# Altium project CLOCK.PrjPcb
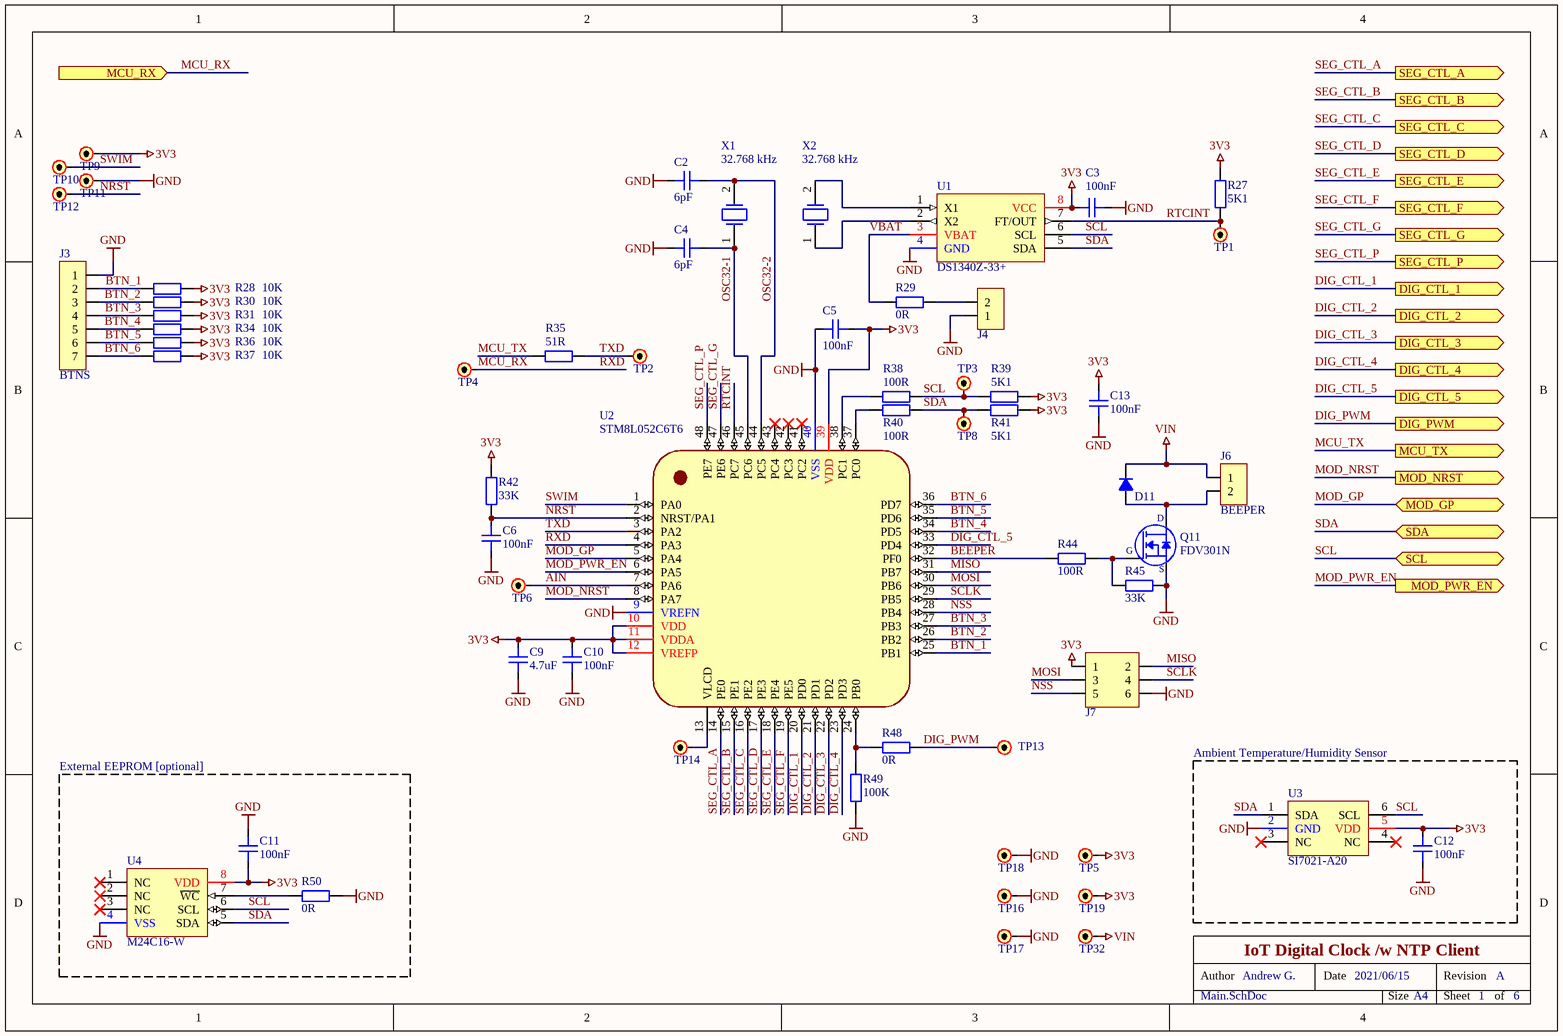
[diagram p0: Main.SchDoc]
Title: IoT Digital Clock /w NTP Client; SheetTotal: 6; Revision: A; DrawnBy: Andrew G.; Date: 2021/06/15
5 sheets, 193 parts. Net scope: flat (ports and power ports of the same name join across sheets).
Board file: CLOCK.PcbDoc
Sheets:
  Main.SchDoc
  Anode.SchDoc
  PowerIn.SchDoc
  WiFi.SchDoc
  Cathode.SchDoc

## Sheet Main.SchDoc: IoT Digital Clock /w NTP Client
size A4; Date: 2021/06/15; DrawnBy: Andrew G.; DocumentNumber: 1; Revision: A; SheetNumber: 1; SheetTotal: 6; ProjectName: CLOCK.PrjPcb

### Parts
C2  6pF  [0603C_RF_M]
C3  100nF  [0603C_RF_M]
C4  6pF  [0603C_RF_M]
C5  100nF  [0603C_RF_M]
C6  100nF  [0603C_RF_M]
C9  4.7uF  [0603C_RF_M]
C10  100nF  [0603C_RF_M]
C11  100nF  [0603C_RF_M]
C12  100nF  [0603C_RF_M]
C13  100nF  [0805C_RF_M]
D11  D  [ONSEMI_DO214AC_RF_M]  (value not drawn)
J3  BTNS  [HEADER-2.54-7P1]
J4  PINHDR-2P1  [HEADER-2.54-2P1]  (value not drawn)
J6  BEEPER  [HEADER-2.54-2P1]
J7  PINHDR-6P2-2.54  [HEADER-2.54-6P-2R]  (value not drawn)
Q11  FDV301N  [IRLML_SOT-23]
R27  5K1  [0603R_RF_M]
R28  10K  [0603R_RF_M]
R29  0R  [0805R_RF_M]
R30  10K  [0603R_RF_M]
R31  10K  [0603R_RF_M]
R34  10K  [0603R_RF_M]
R35  51R  [0603R_RF_M]
R36  10K  [0603R_RF_M]
R37  10K  [0603R_RF_M]
R38  100R  [0603R_RF_M]
R39  5K1  [0805R_RF_M]
R40  100R  [0603R_RF_M]
R41  5K1  [0805R_RF_M]
R42  33K  [0603R_RF_M]
R44  100R  [0805R_RF_M]
R45  33K  [0805R_RF_M]
R48  0R  [0603R_RF_M]
R49  100K  [0603R_RF_M]
R50  0R  [0603R_RF_M]
TP1  RTCINT  [PAD_R_1MM]  (value not drawn)
TP2  MCU_TX  [PAD_R_1MM]  (value not drawn)
TP3  SCL  [PAD_R_1MM]  (value not drawn)
TP4  MCU_RX  [PAD_R_1MM]  (value not drawn)
TP5  3V3  [PAD_R_1.5MM]  (value not drawn)
TP6  3V3  [PAD_R_1MM]  (value not drawn)
TP8  SDA  [PAD_R_1MM]  (value not drawn)
TP9  VDD  [PAD_R_1MM]  (value not drawn)
TP10  SWIM  [PAD_R_1MM]  (value not drawn)
TP11  GND  [PAD_R_1MM]  (value not drawn)
TP12  NRST  [PAD_R_1MM]  (value not drawn)
TP13  PWM  [PAD_R_1MM]  (value not drawn)
TP14  VLCD  [PAD_R_1MM]  (value not drawn)
TP16  GND  [PAD_R_1.5MM]  (value not drawn)
TP17  GND  [PAD_R_1.5MM]  (value not drawn)
TP18  GND  [PAD_R_1.5MM]  (value not drawn)
TP19  3V3  [PAD_R_1.5MM]  (value not drawn)
TP32  VIN  [PAD_R_1.5MM]  (value not drawn)
U1  DS1340Z-33+  [SOIC-8]
U2  STM8L052C6T6  [ST_LQFP-48]
U3  SI7021-A20  [SI7021_DFN-6_RF_M]
U4  M24C16-W  [SOIC-8]
X1  32.768 kHz  [XTAL_3215]
X2  32.768 kHz  [XTAL_3215]

### Blocks framed on the sheet
External EEPROM [optional]: C11 R50 U4
Ambient Temperature/Humidity Sensor: C12 U3

### Ports
DIG_CTL_1 (out), DIG_CTL_2 (out), DIG_CTL_3 (out), DIG_CTL_4 (out), DIG_CTL_5 (out), DIG_PWM (out), MCU_RX (in), MCU_TX (out), MOD_GP (bidir), MOD_NRST (out), MOD_PWR_EN (out), SCL (bidir), SDA (bidir), SEG_CTL_A (out), SEG_CTL_B (out), SEG_CTL_C (out), SEG_CTL_D (out), SEG_CTL_E (out), SEG_CTL_F (out), SEG_CTL_G (out), SEG_CTL_P (out)

### Nets
3V3: C3.2 C5.1 C9.2 C10.2 C11.2 C12.2 C13.2 J7.1 R27.2 R28.2 R30.2 R31.2 R34.2 R36.2 R37.2 R39.2 R41.2 R42.2 TP5.1 TP9.1 TP19.1 U1.8(VCC) U2.10(VDD) U2.11(VDDA) U2.12(VREFP) U2.39(VDD) U3.5(VDD) U4.8(VDD)
GND: C2.2 C3.1 C4.2 C5.2 C6.1 C9.1 C10.1 C11.1 C12.1 C13.1 J3.1 J4.1 J7.6 Q11.2(S) R45.1 R49.2 R50.2 TP11.1 TP16.1 TP17.1 TP18.1 U1.4(GND) U2.9(VREFN) U2.40(VSS) U3.2(GND) U4.4(VSS)
VIN: D11.C J6.1 TP32.1
AIN: TP6.1 U2.7(PA6)
BEEPER: R44.1 U2.32(PF0)
BTN_1: J3.2 R28.1 U2.25(PB1)
BTN_2: J3.3 R30.1 U2.26(PB2)
BTN_3: J3.4 R31.1 U2.27(PB3)
BTN_4: J3.5 R34.1 U2.34(PD5)
BTN_5: J3.6 R36.1 U2.35(PD6)
BTN_6: J3.7 R37.1 U2.36(PD7)
DIG_CTL_1: U2.20(PD0) ; port DIG_CTL_1
DIG_CTL_2: U2.21(PD1) ; port DIG_CTL_2
DIG_CTL_3: U2.22(PD2) ; port DIG_CTL_3
DIG_CTL_4: U2.23(PD3) ; port DIG_CTL_4
DIG_CTL_5: U2.33(PD4) ; port DIG_CTL_5
DIG_PWM: R48.1 TP13.1 ; port DIG_PWM
MCU_RX: TP4.1 U2.4(PA3) ; port MCU_RX  [also labelled RXD]
MCU_TX: R35.1 ; port MCU_TX
MISO: J7.2 U2.31(PB7)
MOD_GP: U2.5(PA4) ; port MOD_GP
MOD_NRST: U2.8(PA7) ; port MOD_NRST
MOD_PWR_EN: U2.6(PA5) ; port MOD_PWR_EN
MOSI: J7.3 U2.30(PB6)
NRST: C6.2 R42.1 TP12.1 U2.2(NRST/PA1)
NSS: J7.5 U2.28(PB4)
OSC32-1: C4.1 U2.45(PC6) X1.1
OSC32-2: C2.1 U2.44(PC5) X1.2
RTCINT: R27.1 TP1.1 U1.7(FT/OUT) U2.46(PC7)
SCL: R38.2 R39.1 TP3.1 U1.6(SCL) U3.6(SCL) U4.6(SCL) ; port SCL  [project net MCU_SCL]
SCLK: J7.4 U2.29(PB5)
SDA: R40.2 R41.1 TP8.1 U1.5(SDA) U3.1(SDA) U4.5(SDA) ; port SDA  [project net MCU_SDA]
SEG_CTL_A: U2.14(PE0) ; port SEG_CTL_A
SEG_CTL_B: U2.15(PE1) ; port SEG_CTL_B
SEG_CTL_C: U2.16(PE2) ; port SEG_CTL_C
SEG_CTL_D: U2.17(PE3) ; port SEG_CTL_D
SEG_CTL_E: U2.18(PE4) ; port SEG_CTL_E
SEG_CTL_F: U2.19(PE5) ; port SEG_CTL_F
SEG_CTL_G: U2.47(PE6) ; port SEG_CTL_G
SEG_CTL_P: U2.48(PE7) ; port SEG_CTL_P
SWIM: TP10.1 U2.1(PA0)
TXD: R35.2 TP2.1 U2.3(PA2)
VBAT: R29.2 U1.3(VBAT)
NetD11_A: D11.A J6.2 Q11.3(D)
NetJ4_2: J4.2 R29.1
NetQ11_1: Q11.1(G) R44.2 R45.2
NetR38_1: R38.1 U2.38(PC1)
NetR40_1: R40.1 U2.37(PC0)
NetR48_2: R48.2 R49.1 U2.24(PB0)
NetR50_1: R50.1 U4.7(~{WC})
NetTP14_1: TP14.1 U2.13(VLCD)
NetU1_1: U1.1(X1) X2.2
NetU1_2: U1.2(X2) X2.1

Not connected (* = marked no-connect by the designer): U2 41(PC2)* 42(PC3)* 43(PC4)*; U3 3(NC)* 4(NC)*; U4 1(NC)* 2(NC)* 3(NC)*

### Notes on the sheet
- Author
- Date
- Revision
- Size
- A4
- Sheet
- of

### Library data of the parts
C2-C6 C9-C13 = C: Capacitor; Manufacturer: Generic Brand; Max Voltage: ? V; Tolerance: ?; Mounting Technology: SMT; Tag: *; Manufacturer Part No: *; Supplier: *; Supplier Link: http://; Supplier Part No: *; Category: Capacitor
  C2 C4: Value: 6pF
  C3 C5 C6 C10-C13: Value: 100nF
  C9: Value: 4.7uF
D11 = D: Diode (Rectifier); Manufacturer: Generic Brand; Max Forward Voltage: ? V; Power Rating: ? W; Manufacturer Part No: *; Supplier: *; Supplier Link: http://; Supplier Part No: *; Mounting Technology: SMT; Category: Diode
J3 = PINHDR-7P1: Pin Header Single Row 7 Positions; Mounting Technology: THT
J4 J6 = PINHDR-2P1: Pin Header Single Row 2 Positions; Mounting Technology: THT
J7 = PINHDR-6P2-2.54: Rectangular Pin Header 6 Positions 2 Rows
Q11 = FDV301N: MOSFET N-CH 25V 220MA SOT23; Manufacturer: ON Semiconductor; Manufacturer Part No: FDV301N; Supplier: DigiKey; Supplier Link: https://www.digikey.com/en/products/detail/on-semiconductor/FDV301N/458851; Supplier Part No: FDV301NCT-ND; Mounting Technology: SMT; Package: SOT-23; Alternative Supplier: Chipdip; Alternative Supplier Part No: 9010000157; Alternative Supplier Link: https://www.chipdip.by/product/fdv301n-2
R27-R31 R34-R42 R44 R45 R48-R50 = R: Resistor; Manufacturer: Generic Brand; Power Rating: ? W; Max Voltage: ? V; Tolerance: ?; Supplier Link: http://; Category: Resistor; Mounting Technology: SMT
  R27 R39 R41: Value: 5K1
  R28 R30 R31 R34 R36 R37: Value: 10K
  R29 R48 R50: Value: 0R
  R35: Value: 51R
  R38 R40 R44: Value: 100R
  R42 R45: Value: 33K
  R49: Value: 100K
TP1-TP6 TP8-TP14 TP16-TP19 TP32 = Test Point: Test Point / Pad
U1 = DS1340Z-33+: IC RTC CLK/CALENDAR I2C 8-SOIC; Manufacturer: Maxim Integrated; VCC: 3.3V; Manufacturer Part No: DS1340Z-33+; Alternative Supplier: Chipdip; Alternative Supplier Link: https://www.chipdip.by/product/ds1340z-33-2; Alternative Supplier Part No: 9000387657; Supplier Part No: DS1340Z-33+-ND; Supplier: DigiKey; Supplier Link: https://www.digikey.com/en/products/detail/maxim-integrated/DS1340Z-33/680583; Mounting Technology: SMT; Package: SOIC-8; Category: IC/RTC
U2 = STM8L052C6T6: IC MCU 8BIT 32KB FLASH 48LQFP; Manufacturer: STMicroelectronics; Supplier: DigiKey; Supplier Link: https://www.digikey.com/en/products/detail/stmicroelectronics/STM8L052C6T6/3317784; Supplier Part No: 497-13041-ND; Manufacturer Product Number: STM8L052C6T6; Package: LQFP-48; Mounting Technology: SMT
U3 = SI7021-A20: SENS HUMID/TEMP 3.6V I2C 2% 6DFN; Manufacturer Product Number: SI7021-A20-GM1R; Manufacturer: Silicon Labs; Supplier URL: https://www.digikey.com/en/products/detail/silicon-labs/SI7021-A20-GM1/5048934; Supplier Part No: 336-4380-1-ND; Supplier Package: Cut Tape (CT); Mounting Type: SMT; Package: DFN-6
U4 = M24C16-W: IC SRL EEPROM 16KBIT 2.5V 8-SOIC; Manufacturer: STMicroelectronics; Manufacturer Product Number: M24C16-WMN6TP; Base Product Number: M24C16; Supplier: DigiKey; Supplier URL: https://www.digikey.com/en/products/detail/stmicroelectronics/M24C16-WMN6TP/1007246; Supplier Part No: 497-17785-1-ND; Supplier Package: Cut Tape; Mounting Type: SMT; Operating Temperature: -40°C ~ 85°C (TA); Supplier Price: $0.14
X1 X2 = KX-327NHT: Crystal Resonator (2 Leads); Manufacturer: Geyer; Load Capacitance: 12.5 pF; Tolerance: 20 ppm; Manufacturer Part No: KX-327NHT; Mounting Technology: SMT; Alternative Supplier: Belchip; Alternative Supplier Link: https://belchip.by/product/?selected_product=33387; Alternative Supplier Part No: 33387; Category: Crystal; Value: 32.768 kHz

## Sheet Anode.SchDoc: IoT Digital Clock /w NTP Client
size A4; Date: 2021/06/15; DrawnBy: Andrew G.; DocumentNumber: 1; Revision: A; SheetNumber: 2; SheetTotal: 6; ProjectName: CLOCK.PrjPcb
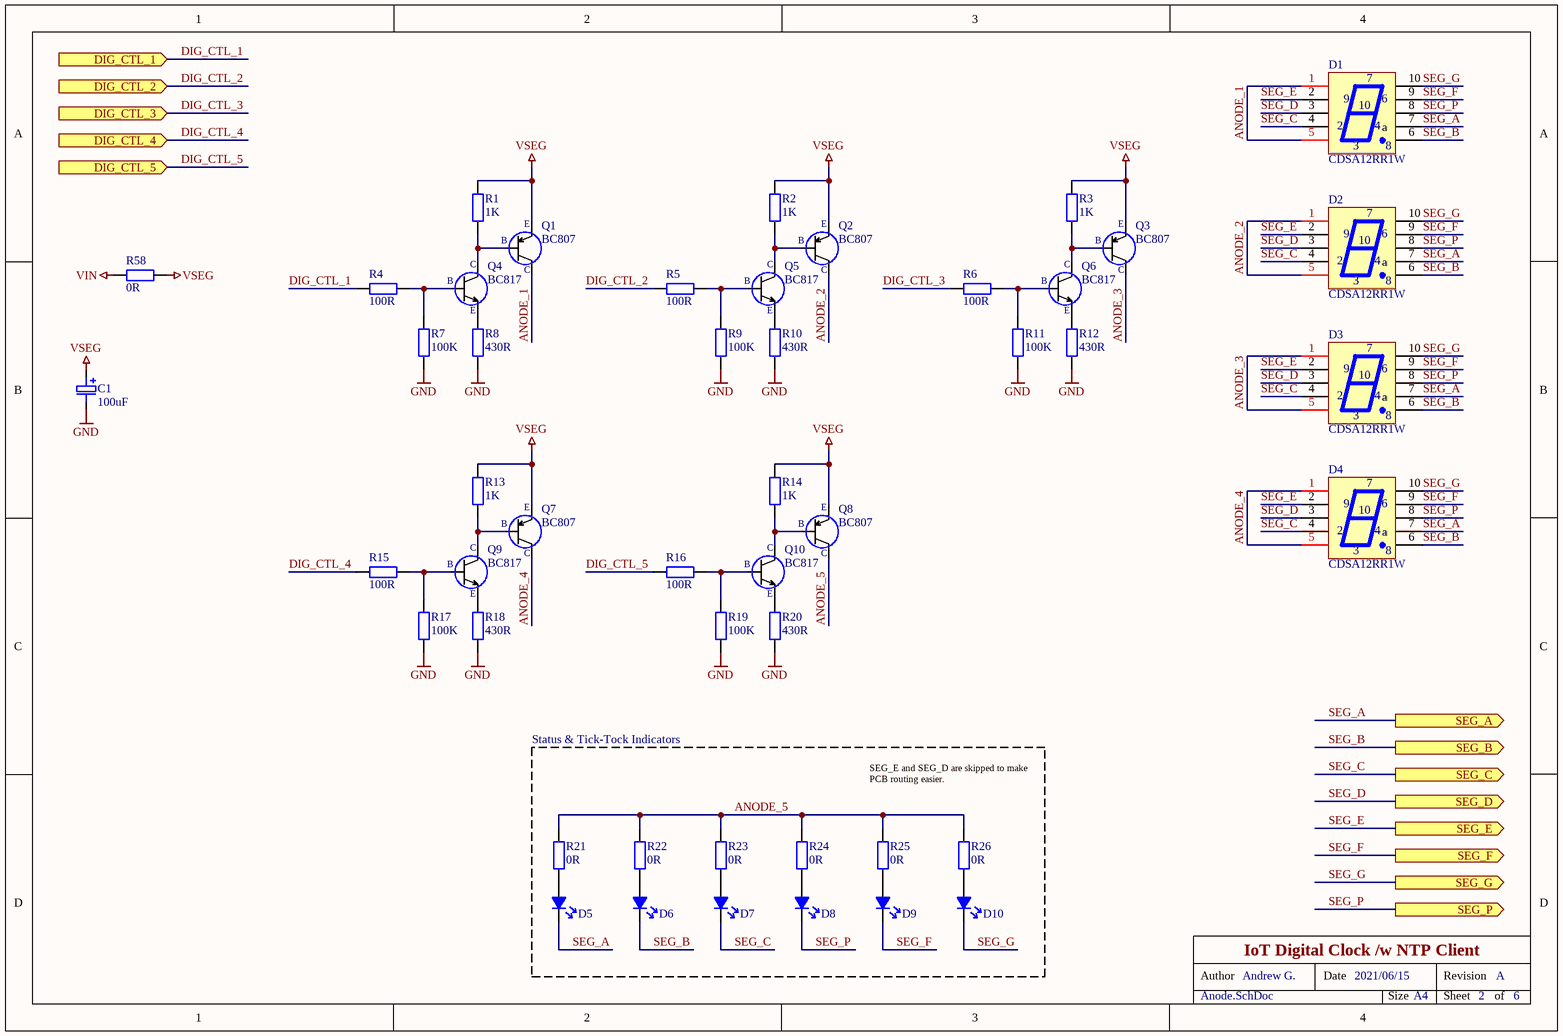
[diagram p1: Anode.SchDoc]

### Parts
C1  100uF  [C_EL_B_4MM_RF_M]
D1  CDSA12RR1W  [CDSX12]
D2  CDSA12RR1W  [CDSX12]
D3  CDSA12RR1W  [CDSX12]
D4  CDSA12RR1W  [CDSX12]
D5  Unspecified  [1206LED_RF_M]  (value not drawn)
D6  Unspecified  [1206LED_RF_M]  (value not drawn)
D7  Unspecified  [1206LED_RF_M]  (value not drawn)
D8  Unspecified  [1206LED_RF_M]  (value not drawn)
D9  Unspecified  [1206LED_RF_M]  (value not drawn)
D10  Unspecified  [1206LED_RF_M]  (value not drawn)
Q1  BC807  [IRLML_SOT-23]
Q2  BC807  [IRLML_SOT-23]
Q3  BC807  [IRLML_SOT-23]
Q4  BC817  [IRLML_SOT-23]
Q5  BC817  [IRLML_SOT-23]
Q6  BC817  [IRLML_SOT-23]
Q7  BC807  [IRLML_SOT-23]
Q8  BC807  [IRLML_SOT-23]
Q9  BC817  [IRLML_SOT-23]
Q10  BC817  [IRLML_SOT-23]
R1  1K  [0805R_RF_M]
R2  1K  [0805R_RF_M]
R3  1K  [0805R_RF_M]
R4  100R  [0805R_RF_M]
R5  100R  [0805R_RF_M]
R6  100R  [0805R_RF_M]
R7  100K  [0805R_RF_M]
R8  430R  [0805R_RF_M]
R9  100K  [0805R_RF_M]
R10  430R  [0805R_RF_M]
R11  100K  [0805R_RF_M]
R12  430R  [0805R_RF_M]
R13  1K  [0805R_RF_M]
R14  1K  [0805R_RF_M]
R15  100R  [0805R_RF_M]
R16  100R  [0805R_RF_M]
R17  100K  [0805R_RF_M]
R18  430R  [0805R_RF_M]
R19  100K  [0805R_RF_M]
R20  430R  [0805R_RF_M]
R21  0R  [0805R_RF_M]
R22  0R  [0805R_RF_M]
R23  0R  [0805R_RF_M]
R24  0R  [0805R_RF_M]
R25  0R  [0805R_RF_M]
R26  0R  [0805R_RF_M]
R58  0R  [1206R_RF_M]

### Blocks framed on the sheet
Status & Tick-Tock Indicators: D5-D10 R21-R26

### Ports
DIG_CTL_1 (in), DIG_CTL_2 (in), DIG_CTL_3 (in), DIG_CTL_4 (in), DIG_CTL_5 (in), SEG_A (out), SEG_B (out), SEG_C (out), SEG_D (out), SEG_E (out), SEG_F (out), SEG_G (out), SEG_P (out)

### Nets
GND: C1.N R7.1 R8.1 R9.1 R10.1 R11.1 R12.1 R17.1 R18.1 R19.1 R20.1
VIN: R58.1
VSEG: C1.P Q1.2(Emmiter) Q2.2(Emmiter) Q3.2(Emmiter) Q7.2(Emmiter) Q8.2(Emmiter) R1.2 R2.2 R3.2 R13.2 R14.2 R58.2
ANODE_1: D1.1(A) D1.5(A) Q1.3(Collector)
ANODE_2: D2.1(A) D2.5(A) Q2.3(Collector)
ANODE_3: D3.1(A) D3.5(A) Q3.3(Collector)
ANODE_4: D4.1(A) D4.5(A) Q7.3(Collector)
ANODE_5: Q8.3(Collector) R21.2 R22.2 R23.2 R24.2 R25.2 R26.2
DIG_CTL_1: R4.1 ; port DIG_CTL_1
DIG_CTL_2: R5.1 ; port DIG_CTL_2
DIG_CTL_3: R6.1 ; port DIG_CTL_3
DIG_CTL_4: R15.1 ; port DIG_CTL_4
DIG_CTL_5: R16.1 ; port DIG_CTL_5
SEG_A: D1.7(a) D2.7(a) D3.7(a) D4.7(a) D5.C ; port SEG_A
SEG_B: D1.6(b) D2.6(b) D3.6(b) D4.6(b) D6.C ; port SEG_B
SEG_C: D1.4(c) D2.4(c) D3.4(c) D4.4(c) D7.C ; port SEG_C
SEG_D: D1.3(d) D2.3(d) D3.3(d) D4.3(d) ; port SEG_D
SEG_E: D1.2(e) D2.2(e) D3.2(e) D4.2(e) ; port SEG_E
SEG_F: D1.9(f) D2.9(f) D3.9(f) D4.9(f) D9.C ; port SEG_F
SEG_G: D1.10(g) D2.10(g) D3.10(g) D4.10(g) D10.C ; port SEG_G
SEG_P: D1.8(dp) D2.8(dp) D3.8(dp) D4.8(dp) D8.C ; port SEG_P
NetD5_A: D5.A R21.1
NetD6_A: D6.A R22.1
NetD7_A: D7.A R23.1
NetD8_A: D8.A R24.1
NetD9_A: D9.A R25.1
NetD10_A: D10.A R26.1
NetQ1_1: Q1.1(Base) Q4.3(Collector) R1.1
NetQ2_1: Q2.1(Base) Q5.3(Collector) R2.1
NetQ3_1: Q3.1(Base) Q6.3(Collector) R3.1
NetQ4_1: Q4.1(Base) R4.2 R7.2
NetQ4_2: Q4.2(Emmiter) R8.2
NetQ5_1: Q5.1(Base) R5.2 R9.2
NetQ5_2: Q5.2(Emmiter) R10.2
NetQ6_1: Q6.1(Base) R6.2 R11.2
NetQ6_2: Q6.2(Emmiter) R12.2
NetQ7_1: Q7.1(Base) Q9.3(Collector) R13.1
NetQ8_1: Q8.1(Base) Q10.3(Collector) R14.1
NetQ9_1: Q9.1(Base) R15.2 R17.2
NetQ9_2: Q9.2(Emmiter) R18.2
NetQ10_1: Q10.1(Base) R16.2 R19.2
NetQ10_2: Q10.2(Emmiter) R20.2

### Notes on the sheet
- SEG_E and SEG_D are skipped to make PCB routing easier.
- Author
- Date
- Revision
- Size
- A4
- Sheet
- of
- (in symbol BC807-215) E; B; C
- (in symbol BC817-40-215) C; B; E

### Library data of the parts
C1 = C-P: Polarized Capacitor; Manufacturer: Generic Brand; Max Voltage: ? V; Value: 100uF; Mounting Technology: SMT; Tolerance: ?; Tag: *; Manufacturer Part No: *; Supplier: *; Supplier Link: http://; Supplier Part No: *; Category: Capacitor
D1-D4 = CDSA12RR1W: DISPLAY 7SEG 1.20" SGL RED 10DIP; Supplier: DigiKey; Supplier Link: https://www.digikey.com/en/products/detail/chromeled/CDSA12RR1W/13166753; Supplier Part No: 2661-CDSA12RR1W-ND; Mounting Technology: SMT; Package: DIP-10
D5-D10 = LED: Manufacturer: Generic Brand; Forward Voltage Drop: ? V; Emitting Color: Unspecified; Manufacturer Part No: *; Supplier: *; Supplier Link: http://; Supplier Part No: *; Category: Diode; Mounting Technology: SMT
Q1-Q3 Q7 Q8 = BC807-215: TRANS PNP 45V 500MA TO236AB; DC Current Gain: 100; Power Dissipation: 250mW; Supplier Link: https://www.digikey.com/en/products/detail/nexperia-usa-inc/BC807-215/1232227; Alternative Supplier Link: https://www.chipdip.by/product/bc807.215; Supplier: DigiKey; Alternative Supplier: Chipdip; Alternative Supplier Part No: 9000113306; Supplier Part No: 1727-4840-1-ND; Package: SOT-23; Mounting Technology: SMT; Datasheet Link: https://assets.nexperia.com/documents/data-sheet/BC807_BC807W_BC327.pdf; Collector Current: 500mA; Collector-Emitter Breakdown Voltage: 45V
Q4-Q6 Q9 Q10 = BC817-40-215: TRANS NPN 45V 0.5A SOT23; Manufacturer: Nexperia USA Inc.; Manufacturer Part No: BC817-40,215; Collector Current: 500 mA; Collector-Emitter Breakdown Voltage: 45V (max.); Power Dissipation: 250 mW; DC Current Gain: 250 @ 100mA, 1V; Supplier: DigiKey; Supplier Link: https://www.digikey.com/en/products/detail/nexperia-usa-inc/BC817-40-215/763235; Supplier Part No: 1727-2919-1-ND; Mounting Technology: SMT; Category: Transistor/BJT; Alternative Supplier: Chipdip; Alternative Supplier Link: https://www.chipdip.by/product/bc817-40; Alternative Supplier Part No: 28806907; Datasheet Link: https://assets.nexperia.com/documents/data-sheet/BC817_SER.pdf; Package: SOT-23
R1-R26 R58 = R: as R27 on sheet Main; Tolerance: ?; Supplier Link: http://; Category: Resistor; Mounting Technology: SMT
  R1-R3 R13 R14: Value: 1K
  R4-R6 R15 R16: Value: 100R
  R7 R9 R11 R17 R19: Value: 100K
  R8 R10 R12 R18 R20: Value: 430R
  R21-R26 R58: Value: 0R

## Sheet PowerIn.SchDoc: IoT Digital Clock /w NTP Client
size A4; Date: 2021/06/15; DrawnBy: Andrew G.; DocumentNumber: 1; Revision: A; SheetNumber: 6; SheetTotal: 6; ProjectName: CLOCK.PrjPcb
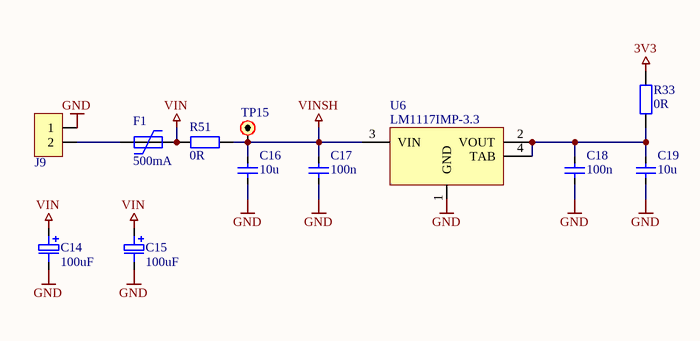
[diagram p2: PowerIn.SchDoc]

### Parts
C14  100uF  [C_EL_B_4MM_RF_M]
C15  100uF  [C_EL_B_4MM_RF_M]
C16  10u  [0805C_RF_M]
C17  100n  [0805C_RF_M]
C18  100n  [0805C_RF_M]
C19  10u  [0805C_RF_M]
F1  500mA  [BOURNS_MF-MSMF110/16-2_RF_H]
J9  PINHDR-2P1  [HEADER-2.54-2P1]  (value not drawn)
R33  0R  [1206R_RF_M]
R51  0R  [1206R_RF_M]
TP15  5V  [PAD_R_1.5MM]  (value not drawn)
U6  LM1117IMP-3.3  [SOT-223]

### Nets
3V3: R33.2
GND: C14.N C15.N C16.1 C17.1 C18.1 C19.1 J9.1 U6.1(GND)
VIN: C14.P C15.P F1.1 R51.1
VINSH: C16.2 C17.2 R51.2 TP15.1 U6.3(VIN)
NetC18_2: C18.2 C19.2 R33.1 U6.2(VOUT) U6.4(TAB)
NetF1_2: F1.2 J9.2

### Notes on the sheet
- Author
- Date
- Revision
- Size
- A4
- Sheet
- of

### Library data of the parts
C14 C15 = C-P: as C1 on sheet Anode; Value: 100uF; Mounting Technology: SMT; Tolerance: ?; Tag: *; Manufacturer Part No: *; Supplier: *; Supplier Link: http://; Supplier Part No: *; Category: Capacitor
C16-C19 = C: as C2 on sheet Main; Tolerance: ?; Mounting Technology: SMT; Tag: *; Manufacturer Part No: *; Supplier: *; Supplier Link: http://; Supplier Part No: *; Category: Capacitor
  C16 C19: Value: 10u
  C17 C18: Value: 100n
F1 = PPTC: Resettable Fuse; Manufacturer: Generic Brand; Max Voltage: ? V; Hold Current: 500mA; Category: Fuse; Mounting Technology: SMT; Supplier Link: http://
J9 = PINHDR-2P1: Pin Header Single Row 2 Positions; Mounting Technology: THT
R33 R51 = R: as R27 on sheet Main; Value: 0R; Tolerance: ?; Supplier Link: http://; Category: Resistor; Mounting Technology: SMT
TP15 = Test Point: Test Point / Pad
U6 = LM1117: Voltage Regulator Linear 1% 800mA SOT-223; Manufacturer: Texas Instruments; VIN_MAX: +15V; VOUT: +3.3V; Case: SOT-223; Product Number: LM1117IMP-3.3; Supplier: Chipdip; Supplier Link: https://www.chipdip.by/product/lm1117imp-3.3-nopb-2; Supplier Part No: 5641124530; Mounting Type: SMT

## Sheet WiFi.SchDoc: IoT Digital Clock /w NTP Client
size A4; Date: 2021/06/15; DrawnBy: Andrew G.; DocumentNumber: 1; Revision: A; SheetNumber: 4; SheetTotal: 6; ProjectName: CLOCK.PrjPcb
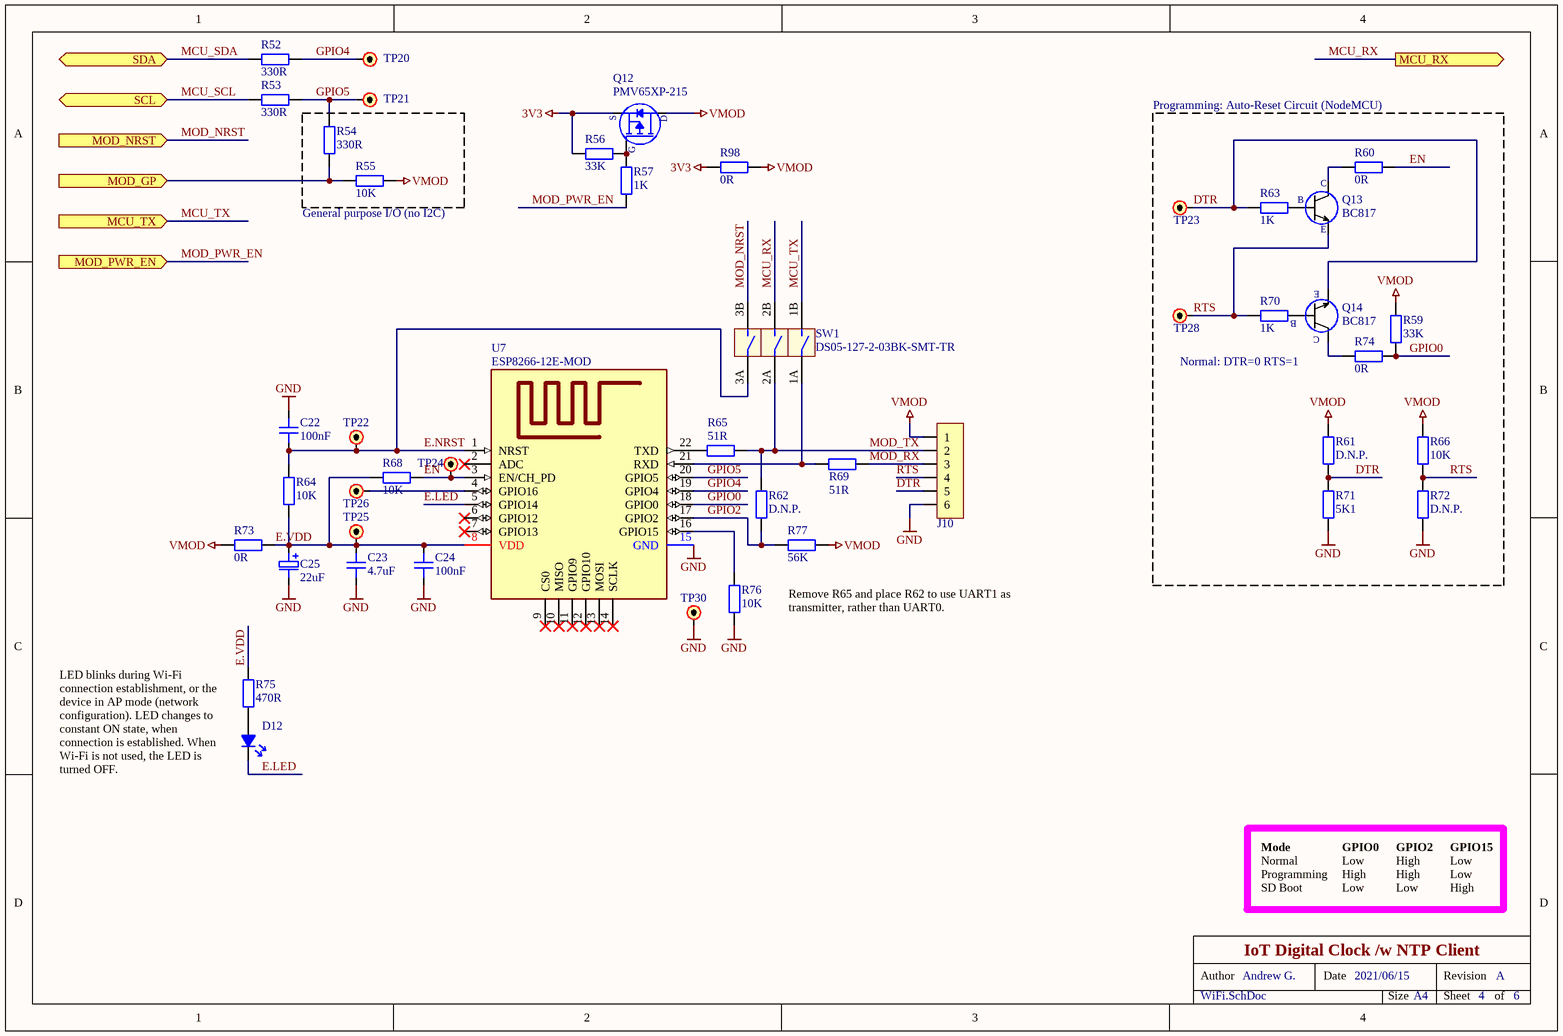
[diagram p3: WiFi.SchDoc]

### Parts
C22  100nF  [0805C_RF_M]
C23  4.7uF  [0805C_RF_M]
C24  100nF  [0805C_RF_M]
C25  22uF  [C_EL_B_4MM_RF_M]
D12  Unspecified  [1206LED_RF_M]  (value not drawn)
J10  PINHDR-6P1  [HEADER-2.54-6P1]  (value not drawn)
Q12  PMV65XP-215  [IRLML_SOT-23]
Q13  BC817  [NXP_SOT-23_RF_M]
Q14  BC817  [NXP_SOT-23_RF_M]
R52  330R  [0805R_RF_M]
R53  330R  [0805R_RF_M]
R54  330R  [0805R_RF_M]
R55  10K  [0805R_RF_M]
R56  33K  [0805R_RF_M]
R57  1K  [0805R_RF_M]
R59  33K  [0805R_RF_M]
R60  0R  [0805R_RF_M]
R61  D.N.P.  [0805R_RF_M]
R62  D.N.P.  [0805R_RF_M]
R63  1K  [0805R_RF_M]
R64  10K  [0805R_RF_M]
R65  51R  [0805R_RF_M]
R66  10K  [0805R_RF_M]
R68  10K  [0805R_RF_M]
R69  51R  [0805R_RF_M]
R70  1K  [0805R_RF_M]
R71  5K1  [0805R_RF_M]
R72  D.N.P.  [0805R_RF_M]
R73  0R  [0805R_RF_M]
R74  0R  [0805R_RF_M]
R75  470R  [0805R_RF_M]
R76  10K  [0805R_RF_M]
R77  56K  [0805R_RF_M]
R98  0R  [0805R_RF_M]
SW1  DS05-127-2-03BK-SMT-TR  [DIP_SWITCH_3POS_1.27mm]
TP20  G.4  [PAD_R_1MM]  (value not drawn)
TP21  G.5  [PAD_R_1MM]  (value not drawn)
TP22  NRST  [PAD_R_1MM]  (value not drawn)
TP23  DTR  [PAD_R_1MM]  (value not drawn)
TP24  CH_PD  [PAD_R_1MM]  (value not drawn)
TP25  E.VDD  [PAD_R_1.5MM]  (value not drawn)
TP26  WAKE  [PAD_R_1MM]  (value not drawn)
TP28  RTS  [PAD_R_1MM]  (value not drawn)
TP30  GND  [PAD_R_1.5MM]  (value not drawn)
U7  ESP8266-12E-MOD  [ESP8266-12E-NBP-MOD]

### Ports
MCU_RX (out), MCU_TX (in), MOD_GP (in), MOD_NRST (in), MOD_PWR_EN (in), SCL (bidir), SDA (bidir)

### Nets
3V3: Q12.2(Source) R56.1 R98.2
GND: C22.1 C23.1 C24.1 C25.N J10.6 R71.2 R72.2 R76.1 TP30.1 U7.15(GND)
VMOD: J10.1 Q12.3(Drain) R55.2 R59.2 R61.1 R66.1 R73.2 R77.1 R98.1
DTR: J10.5 Q14.2(Emmiter) R61.2 R63.1 R71.1 TP23.1
E.LED: D12.C U7.5(GPIO14)
E.NRST: C22.2 R64.1 SW1.3A TP22.1 U7.1(NRST)
E.VDD: C23.2 C24.2 C25.P R64.2 R68.1 R73.1 R75.1 TP25.1 U7.8(VDD)
EN: R60.2 R68.2 TP24.1 U7.3(EN/CH_PD)
GPIO0: R59.1 R74.2 U7.18(GPIO0)
GPIO2: R62.1 R77.2 U7.17(GPIO2)
GPIO4: R52.2 TP20.1 U7.19(GPIO4)
GPIO5: R53.2 R54.2 TP21.1 U7.20(GPIO5)
MCU_RX: SW1.2B ; port MCU_RX
MCU_SCL: R53.1 ; port SCL
MCU_SDA: R52.1 ; port SDA
MCU_TX: SW1.1B ; port MCU_TX
MOD_GP: R54.1 R55.1 ; port MOD_GP
MOD_NRST: SW1.3B ; port MOD_NRST
MOD_PWR_EN: R57.1 ; port MOD_PWR_EN
MOD_RX: J10.3 R69.2
MOD_TX: J10.2 R62.2 R65.2 SW1.2A
RTS: J10.4 Q13.2(Emmiter) R66.2 R70.1 R72.1 TP28.1
NetD12_A: D12.A R75.2
NetQ12_1: Q12.1(Gate) R56.2 R57.2
NetQ13_1: Q13.1(Base) R63.2
NetQ13_3: Q13.3(Collector) R60.1
NetQ14_1: Q14.1(Base) R70.2
NetQ14_3: Q14.3(Collector) R74.1
NetR65_1: R65.1 U7.22(TXD)
NetR69_1: R69.1 SW1.1A U7.21(RXD)
NetR76_2: R76.2 U7.16(GPIO15)
NetTP26_1: TP26.1 U7.4(GPIO16)

Not connected (* = marked no-connect by the designer): U7 2(ADC)* 6(GPIO12)* 7(GPIO13)* 9(CS0)* 10(MISO)* 11(GPIO9)* 12(GPIO10)* 13(MOSI)* 14(SCLK)*

### Notes on the sheet
- Programming: Auto-Reset Circuit (NodeMCU)
- (near R55) General purpose I/O (no I2C)
- Normal: DTR=0 RTS=1
- Remove R65 and place R62 to use UART1 as transmitter, rather than UART0.
- LED blinks during Wi-Fi connection establishment, or the device in AP mode (network configuration). LED changes to constant ON state, when connection is established. When Wi-Fi is not used, the LED is turned OFF.
- Mode
- GPIO0
- GPIO2
- GPIO15
- Normal
- Programming
- SD Boot
- Low
- High
- Author
- Date
- Revision
- Size
- A4
- Sheet
- of
- (in symbol BC817-40-215) C; B; E
- (in symbol PMV65XP-215) S; D; G

### Library data of the parts
C22-C24 = C: as C2 on sheet Main; Tolerance: ?; Mounting Technology: SMT; Tag: *; Manufacturer Part No: *; Supplier: *; Supplier Link: http://; Supplier Part No: *; Category: Capacitor
  C22 C24: Value: 100nF
  C23: Value: 4.7uF
C25 = C-P: as C1 on sheet Anode; Value: 22uF; Mounting Technology: SMT; Tolerance: ?; Tag: *; Manufacturer Part No: *; Supplier: *; Supplier Link: http://; Supplier Part No: *; Category: Capacitor
D12 = LED: as D5 on sheet Anode; Emitting Color: Unspecified; Manufacturer Part No: *; Supplier: *; Supplier Link: http://; Supplier Part No: *; Category: Diode; Mounting Technology: SMT
J10 = PINHDR-6P1: Pin Header Single Row 6 Positions; Mounting Technology: THT
Q12 = PMV65XP-215: MOSFET P-CH 20V 2.8A 23SOT; Gate-Source Threshold Voltage: -0.69V (typ.); Drain-Source Breakdown Voltage: -20V; Drain Current: -2.8A (max.); Max Gate-Source Voltage: 12V (abs.); Supplier Part No: 1727-3124-1-ND; Supplier: DigiKey; Supplier Link: https://www.digikey.com/en/products/detail/nexperia-usa-inc/PMV65XP-215/949643; Mounting Technology: SMT; Package: SOT-23; Alternative Supplier: Chipdip; Alternative Supplier Link: https://www.chipdip.by/product/pmv65xp.215; Alternative Supplier Part No: 9000037397
Q13 Q14 = BC817-40-215: as Q4 on sheet Anode; Supplier: DigiKey; Supplier Link: https://www.digikey.com/en/products/detail/nexperia-usa-inc/BC817-40-215/763235; Supplier Part No: 1727-2919-1-ND; Mounting Technology: SMT; Category: Transistor/BJT; Alternative Supplier: Chipdip; Alternative Supplier Link: https://www.chipdip.by/product/bc817-40; Alternative Supplier Part No: 28806907; Datasheet Link: https://assets.nexperia.com/documents/data-sheet/BC817_SER.pdf; Package: SOT-23
R52-R57 R59-R66 R68-R77 R98 = R: as R27 on sheet Main; Tolerance: ?; Supplier Link: http://; Category: Resistor; Mounting Technology: SMT
  R52-R54: Value: 330R
  R55 R64 R66 R68 R76: Value: 10K
  R56 R59: Value: 33K
  R57 R63 R70: Value: 1K
  R60 R73 R74 R98: Value: 0R
  R61 R62 R72: Value: D.N.P.
  R65 R69: Value: 51R
  R71: Value: 5K1
  R75: Value: 470R
  R77: Value: 56K
SW1 = DS05-127-2-03BK-SMT-TR: DIP SWITCH SPST 1.27 PITCH FL 3POS; Supplier: DigiKey; Supplier Part No: DS05-127-2-03BK-SMT-TR; Supplier Link: https://www.digikey.com/en/products/detail/cui-devices/DS05-127-2-03BK-SMT-TR/11310956
TP20-TP26 TP28 TP30 = Test Point: Test Point / Pad
U7 = ESP8266-12E-MOD: RX TXRX MOD WIFI TRACE ANT SMD; Manufacturer: Adafruit Industries LLC; Mounting Technology: SMT; Supplier: DigiKey; Supplier Part No: 1528-1438-ND; Supplier Link: https://www.digikey.com/en/products/detail/adafruit-industries-llc/2491/5761206; Package: Module

## Sheet Cathode.SchDoc: IoT Digital Clock /w NTP Client
size A4; Date: 2021/06/15; DrawnBy: Andrew G.; DocumentNumber: 1; Revision: A; SheetNumber: 1; SheetTotal: 6; ProjectName: CLOCK.PrjPcb
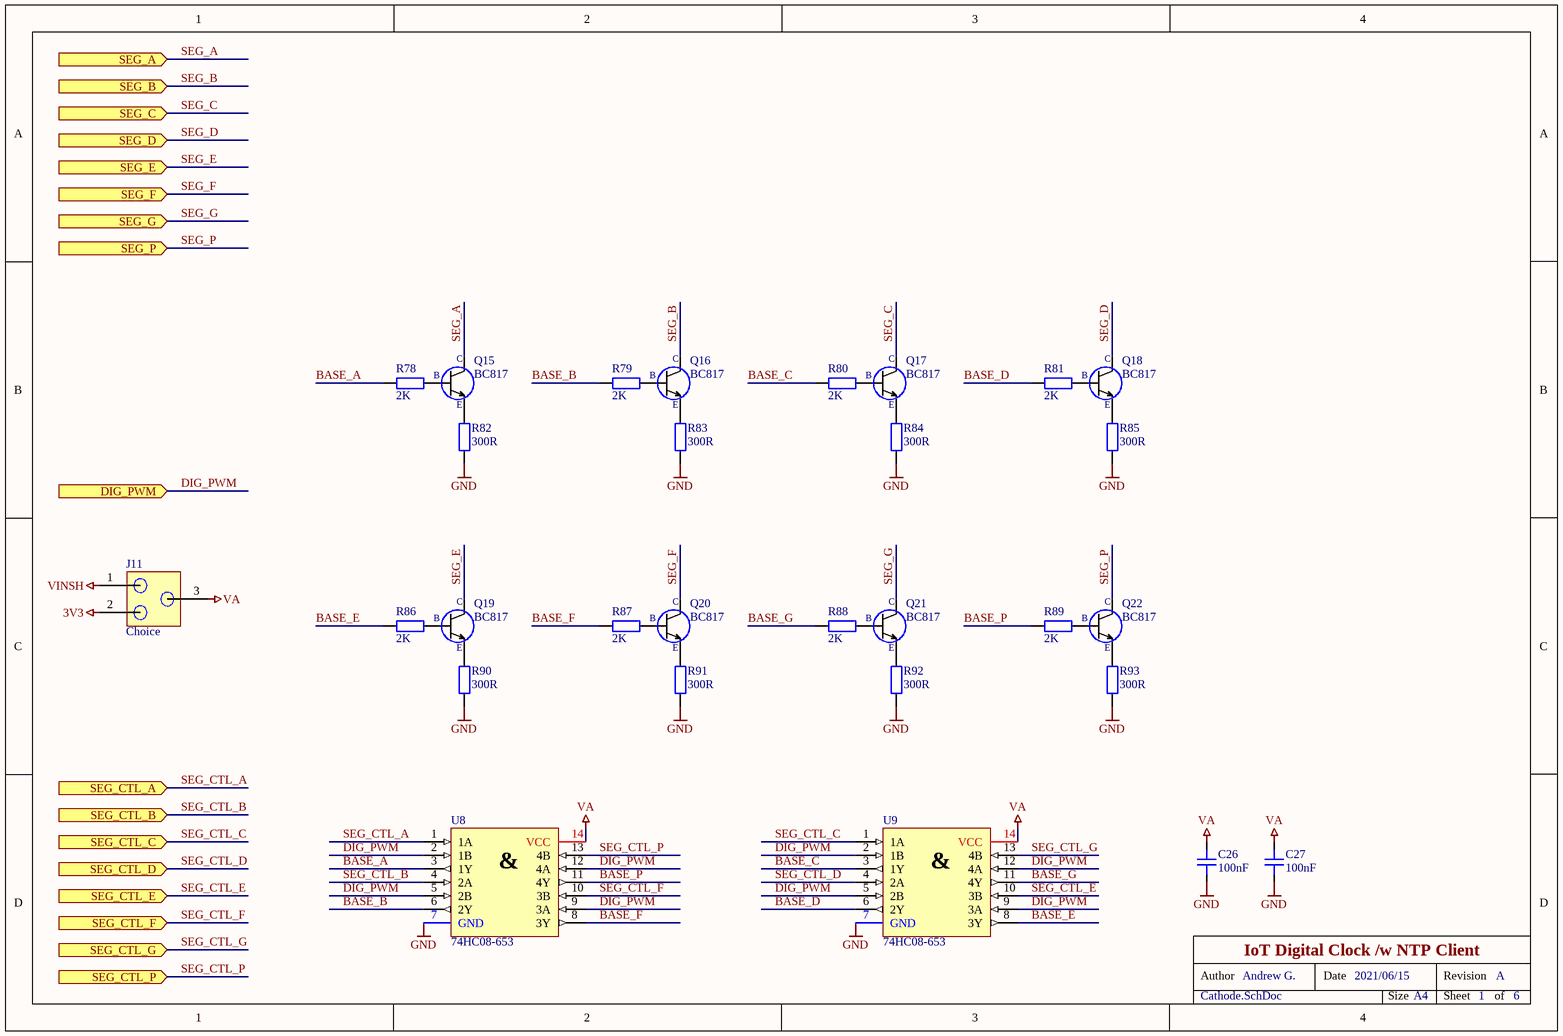
[diagram p4: Cathode.SchDoc]

### Parts
C26  100nF  [0805C_RF_M]
C27  100nF  [0805C_RF_M]
J11  Choice  [CHOICE_R0805]
Q15  BC817  [IRLML_SOT-23]
Q16  BC817  [IRLML_SOT-23]
Q17  BC817  [IRLML_SOT-23]
Q18  BC817  [IRLML_SOT-23]
Q19  BC817  [IRLML_SOT-23]
Q20  BC817  [IRLML_SOT-23]
Q21  BC817  [IRLML_SOT-23]
Q22  BC817  [IRLML_SOT-23]
R78  2K  [0805R_RF_M]
R79  2K  [0805R_RF_M]
R80  2K  [0805R_RF_M]
R81  2K  [0805R_RF_M]
R82  300R  [0805R_RF_M]
R83  300R  [0805R_RF_M]
R84  300R  [0805R_RF_M]
R85  300R  [0805R_RF_M]
R86  2K  [0805R_RF_M]
R87  2K  [0805R_RF_M]
R88  2K  [0805R_RF_M]
R89  2K  [0805R_RF_M]
R90  300R  [0805R_RF_M]
R91  300R  [0805R_RF_M]
R92  300R  [0805R_RF_M]
R93  300R  [0805R_RF_M]
U8  74HC08-653  [SOIC-14]
U9  74HC08-653  [SOIC-14]

### Ports
DIG_PWM (in), SEG_A (in), SEG_B (in), SEG_C (in), SEG_CTL_A (in), SEG_CTL_B (in), SEG_CTL_C (in), SEG_CTL_D (in), SEG_CTL_E (in), SEG_CTL_F (in), SEG_CTL_G (in), SEG_CTL_P (in), SEG_D (in), SEG_E (in), SEG_F (in), SEG_G (in), SEG_P (in)

### Nets
3V3: J11.2
GND: C26.1 C27.1 R82.1 R83.1 R84.1 R85.1 R90.1 R91.1 R92.1 R93.1 U8.7(GND) U9.7(GND)
VA: C26.2 C27.2 J11.3 U8.14(VCC) U9.14(VCC)
VINSH: J11.1
BASE_A: R78.1 U8.3(1Y)
BASE_B: R79.1 U8.6(2Y)
BASE_C: R80.1 U9.3(1Y)
BASE_D: R81.1 U9.6(2Y)
BASE_E: R86.1 U9.8(3Y)
BASE_F: R87.1 U8.8(3Y)
BASE_G: R88.1 U9.11(4Y)
BASE_P: R89.1 U8.11(4Y)
DIG_PWM: U8.2(1B) U8.5(2B) U8.9(3A) U8.12(4A) U9.2(1B) U9.5(2B) U9.9(3A) U9.12(4A) ; port DIG_PWM
SEG_A: Q15.3(Collector) ; port SEG_A
SEG_B: Q16.3(Collector) ; port SEG_B
SEG_C: Q17.3(Collector) ; port SEG_C
SEG_CTL_A: U8.1(1A) ; port SEG_CTL_A
SEG_CTL_B: U8.4(2A) ; port SEG_CTL_B
SEG_CTL_C: U9.1(1A) ; port SEG_CTL_C
SEG_CTL_D: U9.4(2A) ; port SEG_CTL_D
SEG_CTL_E: U9.10(3B) ; port SEG_CTL_E
SEG_CTL_F: U8.10(3B) ; port SEG_CTL_F
SEG_CTL_G: U9.13(4B) ; port SEG_CTL_G
SEG_CTL_P: U8.13(4B) ; port SEG_CTL_P
SEG_D: Q18.3(Collector) ; port SEG_D
SEG_E: Q19.3(Collector) ; port SEG_E
SEG_F: Q20.3(Collector) ; port SEG_F
SEG_G: Q21.3(Collector) ; port SEG_G
SEG_P: Q22.3(Collector) ; port SEG_P
NetQ15_1: Q15.1(Base) R78.2
NetQ15_2: Q15.2(Emmiter) R82.2
NetQ16_1: Q16.1(Base) R79.2
NetQ16_2: Q16.2(Emmiter) R83.2
NetQ17_1: Q17.1(Base) R80.2
NetQ17_2: Q17.2(Emmiter) R84.2
NetQ18_1: Q18.1(Base) R81.2
NetQ18_2: Q18.2(Emmiter) R85.2
NetQ19_1: Q19.1(Base) R86.2
NetQ19_2: Q19.2(Emmiter) R90.2
NetQ20_1: Q20.1(Base) R87.2
NetQ20_2: Q20.2(Emmiter) R91.2
NetQ21_1: Q21.1(Base) R88.2
NetQ21_2: Q21.2(Emmiter) R92.2
NetQ22_1: Q22.1(Base) R89.2
NetQ22_2: Q22.2(Emmiter) R93.2

### Notes on the sheet
- Author
- Date
- Revision
- Size
- A4
- Sheet
- of
- (in symbol 74HC08-653) &
- (in symbol BC817-40-215) C; B; E

### Library data of the parts
C26 C27 = C: as C2 on sheet Main; Value: 100nF; Tolerance: ?; Mounting Technology: SMT; Tag: *; Manufacturer Part No: *; Supplier: *; Supplier Link: http://; Supplier Part No: *; Category: Capacitor
Q15-Q22 = BC817-40-215: as Q4 on sheet Anode; Supplier: DigiKey; Supplier Link: https://www.digikey.com/en/products/detail/nexperia-usa-inc/BC817-40-215/763235; Supplier Part No: 1727-2919-1-ND; Mounting Technology: SMT; Category: Transistor/BJT; Alternative Supplier: Chipdip; Alternative Supplier Link: https://www.chipdip.by/product/bc817-40; Alternative Supplier Part No: 28806907; Datasheet Link: https://assets.nexperia.com/documents/data-sheet/BC817_SER.pdf; Package: SOT-23
R78-R93 = R: as R27 on sheet Main; Tolerance: ?; Supplier Link: http://; Category: Resistor; Mounting Technology: SMT
  R78-R81 R86-R89: Value: 2K
  R82-R85 R90-R93: Value: 300R
U8 U9 = 74HC08-653: Manufacturer: NXP

## Nets that join several sheets
3V3: Main (28 pins), PowerIn (R33.2), WiFi (Q12.2 R56.1 R98.2), Cathode (J11.2)
GND: Main (26 pins), Anode (11 pins), PowerIn (8 pins), WiFi (10 pins), Cathode (12 pins)
VIN: Main (D11.C J6.1 TP32.1), Anode (R58.1), PowerIn (C14.P C15.P F1.1 R51.1)
VINSH: PowerIn (5 pins), Cathode (J11.1)
DIG_CTL_1: Main (U2.20), Anode (R4.1)
DIG_CTL_2: Main (U2.21), Anode (R5.1)
DIG_CTL_3: Main (U2.22), Anode (R6.1)
DIG_CTL_4: Main (U2.23), Anode (R15.1)
DIG_CTL_5: Main (U2.33), Anode (R16.1)
DIG_PWM: Main (R48.1 TP13.1), Cathode (8 pins)
MCU_RX: Main (TP4.1 U2.4), WiFi (SW1.2B)
MCU_SCL: Main (6 pins), WiFi (R53.1)
MCU_SDA: Main (6 pins), WiFi (R52.1)
MCU_TX: Main (R35.1), WiFi (SW1.1B)
MOD_GP: Main (U2.5), WiFi (R54.1 R55.1)
MOD_NRST: Main (U2.8), WiFi (SW1.3B)
MOD_PWR_EN: Main (U2.6), WiFi (R57.1)
SEG_A: Anode (5 pins), Cathode (Q15.3)
SEG_B: Anode (5 pins), Cathode (Q16.3)
SEG_C: Anode (5 pins), Cathode (Q17.3)
SEG_CTL_A: Main (U2.14), Cathode (U8.1)
SEG_CTL_B: Main (U2.15), Cathode (U8.4)
SEG_CTL_C: Main (U2.16), Cathode (U9.1)
SEG_CTL_D: Main (U2.17), Cathode (U9.4)
SEG_CTL_E: Main (U2.18), Cathode (U9.10)
SEG_CTL_F: Main (U2.19), Cathode (U8.10)
SEG_CTL_G: Main (U2.47), Cathode (U9.13)
SEG_CTL_P: Main (U2.48), Cathode (U8.13)
SEG_D: Anode (D1.3 D2.3 D3.3 D4.3), Cathode (Q18.3)
SEG_E: Anode (D1.2 D2.2 D3.2 D4.2), Cathode (Q19.3)
SEG_F: Anode (5 pins), Cathode (Q20.3)
SEG_G: Anode (5 pins), Cathode (Q21.3)
SEG_P: Anode (5 pins), Cathode (Q22.3)